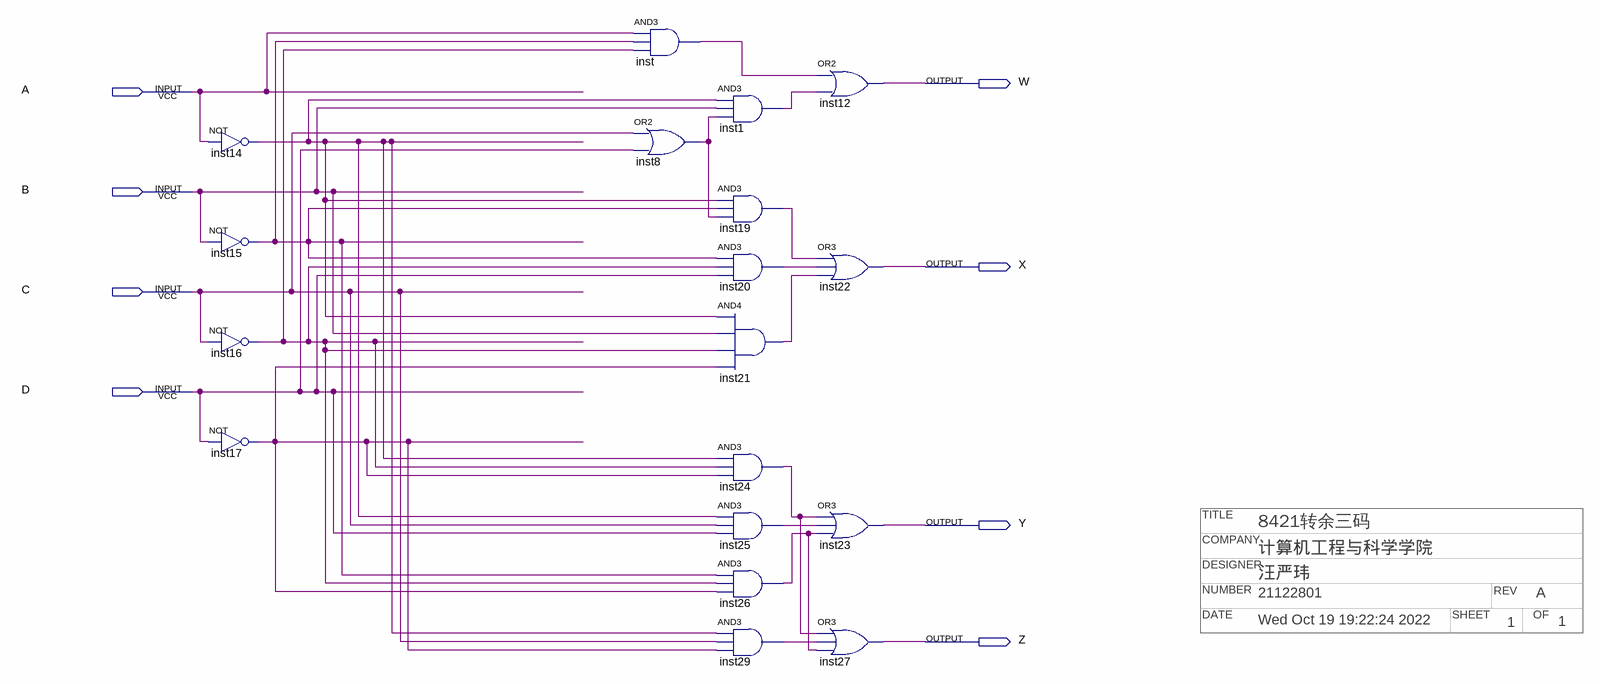
[diagram p0: schematic sheet]
// Quartus schematic 8432_to_3.bdf as structural Verilog: 18 symbols, 8 pins
// Title block: TITLE: 8421转余三码; COMPANY: 计算机工程与科学学院; DESIGNER: 汪严玮; NUMBER: 21122801; REV: A; DATE: Wed Oct 19 19:22:24 2022; SHEET: 1; OF: 1
module \8432_to_3  (
  input  A,
  input  B,
  input  C,
  input  D,
  output W,
  output X,
  output Y,
  output Z
);

  wire inst1_out, inst8_out, inst14_out, inst15_out, inst16_out, inst17_out, inst19_out, inst20_out,
       inst21_out, inst24_out, inst25_out, inst26_out, inst29_out, inst_out;

  not inst14 (inst14_out, A);
  not inst15 (inst15_out, B);
  not inst16 (inst16_out, C);
  not inst17 (inst17_out, D);
  and inst (inst_out, A, inst15_out, inst16_out);
  or inst8 (inst8_out, C, D);
  and inst1 (inst1_out, inst14_out, B, inst8_out);
  and inst19 (inst19_out, inst14_out, inst15_out, inst8_out);
  and inst20 (inst20_out, inst15_out, inst16_out, D);
  and inst21 (inst21_out, inst14_out, B, inst16_out, inst17_out);
  and inst24 (inst24_out, inst14_out, inst16_out, inst17_out);
  and inst25 (inst25_out, inst14_out, C, D);
  and inst26 (inst26_out, inst15_out, inst16_out, inst17_out);
  and inst29 (inst29_out, inst14_out, C, inst17_out);
  or inst12 (W, inst_out, inst1_out);
  or inst22 (X, inst19_out, inst20_out, inst21_out);
  or inst23 (Y, inst24_out, inst25_out, inst26_out);
  or inst27 (Z, inst24_out, inst29_out, inst26_out);
endmodule
